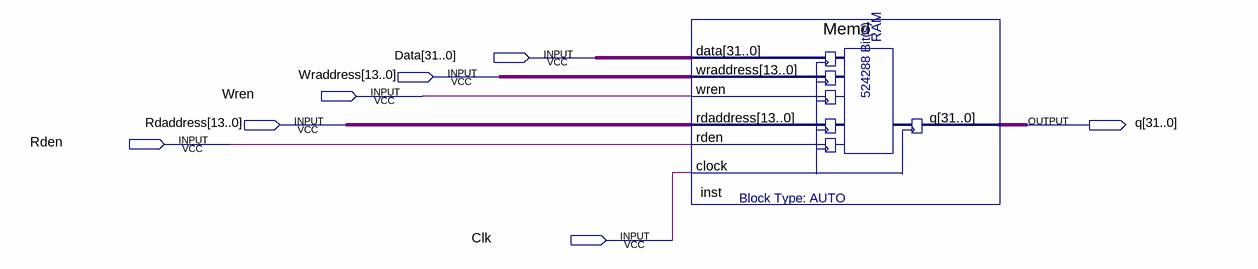
[diagram p0: schematic sheet]
// Quartus schematic Mem_dados.bdf as structural Verilog: 1 symbols, 7 pins
module Mem_dados (
  input  [31:0] Data,
  input  [13:0] Wraddress,
  input  Wren,
  input  [13:0] Rdaddress,
  input  Rden,
  input  Clk,
  output [31:0] q
);

  Memd inst (.data(Data), .wraddress(Wraddress), .wren(Wren), .rdaddress(Rdaddress), .rden(Rden), .clock(Clk), .q(q));
endmodule
